# Altium schematic sheet nguyen li.SchDoc
size A3
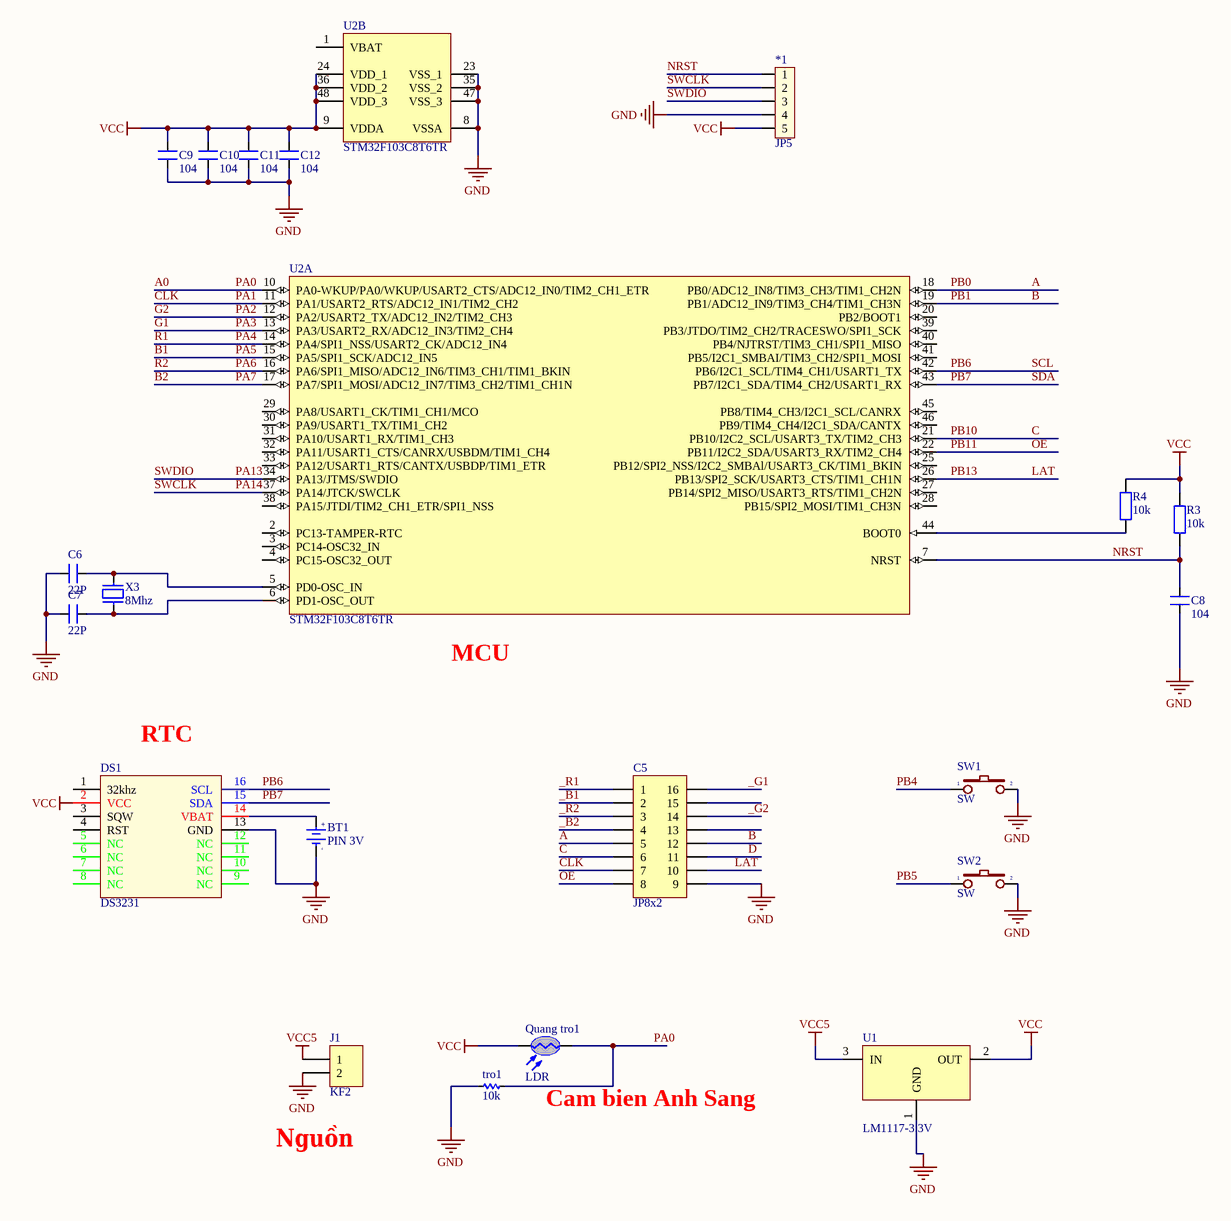
[diagram p0: nguyen li.SchDoc]

## Parts
*1  JP5  [JP5]
BT1  PIN 3V  [PIN CR1220-SMD]
C5  JP8x2  [JP8-D2T]
C6  22P  [0805]
C7  22P  [0805]
C8  104  [0805]
C9  104  [0805]
C10  104  [0805]
C11  104  [0805]
C12  104  [0805]
DS1  DS3231  [DS3231]
J1  KF2  [KF2-5.08]
Quang_tro1  LDR  [CDS]
R3  10k  [SM-RES-0805]
R4  10k  [SM-RES-0805]
SW1  SW  [SW1-SMD]
SW2  SW  [SW1-SMD]
tro1  10k  [RES-SMD-0805]
U1  LM1117-3.3V  [SOT223]
U2  STM32F103C8T6TR  [STM-LQFP48_N]  (parts A,B of 2)
X3  8Mhz  [XT2]

## Nets
GND: *1.4 BT1.2(GND) C5.9 C6.1 C7.1 C8.1 C9.2 C10.2 C11.2 C12.2 DS1.13(GND) J1.2 SW1.2 SW2.2 tro1.2 U1.1(GND) U2.8(VSSA) U2.23(VSS_1) U2.35(VSS_2) U2.47(VSS_3)
VCC: *1.5 C9.1 C10.1 C11.1 C12.1 DS1.2(VCC) Quang_tro1.2(K) R3.1 R4.1 U1.2(OUT) U2.9(VDDA) U2.24(VDD_1) U2.36(VDD_2) U2.48(VDD_3)
VCC5: J1.1 U1.3(IN)
_B1: C5.2
_B2: C5.4
_G1: C5.16
_G2: C5.14
_R1: C5.1
_R2: C5.3
A: C5.5 U2.18(PB0/ADC12_IN8/TIM3_CH3/TIM1_CH2N)  [also labelled PB0]
A0: Quang_tro1.1(A) tro1.1 U2.10(PA0-WKUP/PA0/WKUP/USART2_CTS/ADC12_IN0/TIM2_CH1_ETR)  [also labelled PA0]
B: C5.12 U2.19(PB1/ADC12_IN9/TIM3_CH4/TIM1_CH3N)  [also labelled PB1]
B1: U2.15(PA5/SPI1_SCK/ADC12_IN5)  [also labelled PA5]
B2: U2.17(PA7/SPI1_MOSI/ADC12_IN7/TIM3_CH2/TIM1_CH1N)  [also labelled PA7]
C: C5.6 U2.21(PB10/I2C2_SCL/USART3_TX/TIM2_CH3)  [also labelled PB10]
CLK: C5.7 U2.11(PA1/USART2_RTS/ADC12_IN1/TIM2_CH2)  [also labelled PA1]
D: C5.11
G1: U2.13(PA3/USART2_RX/ADC12_IN3/TIM2_CH4)  [also labelled PA3]
G2: U2.12(PA2/USART2_TX/ADC12_IN2/TIM2_CH3)  [also labelled PA2]
LAT: C5.10 U2.26(PB13/SPI2_SCK/USART3_CTS/TIM1_CH1N)  [also labelled PB13]
NRST: *1.1 C8.2 R3.2 U2.7(NRST)
OE: C5.8 U2.22(PB11/I2C2_SDA/USART3_RX/TIM2_CH4)  [also labelled PB11]
PA4: U2.14(PA4/SPI1_NSS/USART2_CK/ADC12_IN4)  [also labelled R1]
PA6: U2.16(PA6/SPI1_MISO/ADC12_IN6/TIM3_CH1/TIM1_BKIN)  [also labelled R2]
PA13: *1.3 U2.34(PA13/JTMS/SWDIO)  [also labelled SWDIO]
PA14: *1.2 U2.37(PA14/JTCK/SWCLK)  [also labelled SWCLK]
PB4: SW1.1
PB5: SW2.1
PB6: DS1.16(SCL) U2.42(PB6/I2C1_SCL/TIM4_CH1/USART1_TX)  [also labelled SCL]
PB7: DS1.15(SDA) U2.43(PB7/I2C1_SDA/TIM4_CH2/USART1_RX)  [also labelled SDA]
NetBT1_1: BT1.1(+3V) DS1.14(VBAT)
NetC6_2: C6.2 U2.5(PD0-OSC_IN) X3.1
NetC7_2: C7.2 U2.6(PD1-OSC_OUT) X3.2
NetR4_2: R4.2 U2.44(BOOT0)

Not connected (* = marked no-connect by the designer): C5 13 15; DS1 1(32khz) 3(SQW) 4(RST) 5(NC) 6(NC) 7(NC) 8(NC) 9(NC) 10(NC) 11(NC) 12(NC); U2 1(VBAT) 2(PC13-TAMPER-RTC) 3(PC14-OSC32_IN) 4(PC15-OSC32_OUT) 20(PB2/BOOT1) 25(PB12/SPI2_NSS/I2C2_SMBAl/USART3_CK/TIM1_BKIN) 27(PB14/SPI2_MISO/USART3_RTS/TIM1_CH2N) 28(PB15/SPI2_MOSI/TIM1_CH3N) 29(PA8/USART1_CK/TIM1_CH1/MCO) 30(PA9/USART1_TX/TIM1_CH2) 31(PA10/USART1_RX/TIM1_CH3) 32(PA11/USART1_CTS/CANRX/USBDM/TIM1_CH4) 33(PA12/USART1_RTS/CANTX/USBDP/TIM1_ETR) 38(PA15/JTDI/TIM2_CH1_ETR/SPI1_NSS) 39(PB3/JTDO/TIM2_CH2/TRACESWO/SPI1_SCK) 40(PB4/NJTRST/TIM3_CH1/SPI1_MISO) 41(PB5/I2C1_SMBAI/TIM3_CH2/SPI1_MOSI) 45(PB8/TIM4_CH3/I2C1_SCL/CANRX) 46(PB9/TIM4_CH4/I2C1_SDA/CANTX)

## Notes on the sheet
- (near U2) MCU
- (near DS1) RTC
- Nguồn
- Cam bien Anh Sang
- (in symbol PIN 3V) +; -

## Library data of the parts
BT1 = PIN 3V: Battery 3VDC; Value: PIN 3V
C5 = JP8x2: WR-PHD 2.54 mm Dual Socket Header; Manufacturer: W¨¹rth Elektronik eiSos GmbH; partNo: 61301621821; ComponentLink1 Description: Manufacturer; ComponentLink2 Description: Datasheet; NoPins: 16; Created Date: 29 March 2013; ComponentLink1URL: http://www.we-online.com; ComponentLink2URL: http://katalog.we-online.de/em/datasheet/6130xx21821.pdf; Created by: Karrer Zheng
C6-C12 = CM: Cap SMD; Value: 103
J1 = KF2: Manufacturer: Würth Elektronik eiSos GmbH; partNo: 691103110002; ComponentLink1 Description: Manufacturer; ComponentLink2 Description: Datasheet; NoPins: 2; Created Date: 29 October 2013; ComponentLink1URL: http://www.we-online.com; ComponentLink2URL: http://katalog.we-online.de/em/datasheet/6911031100xx.pdf; Created by: Karrer Zheng
Quang_tro1 = LDR: Quang Tro
R3 R4 = R1/4W: Resistor 1/4W; Value: R1/4W - 1K
SW1 SW2 = SW2: Switch button 2 pin; Value: SW chip 2 pin
tro1 = Res-SMD: Resistor; Manufacturer: Generic Components; Class: Passive; Published: 08/06/2000; Publisher: Altium Hobart Technology Centre
U1 = LM1117: 800mA Low-Dropout Linear Regulator; Creator: Nguyen Ba Bien; Website: http://group3i.net
U2 = STM32F103C8T6TR: ARM Cortex-M3 32-bit MCU, 64 KB Flash, 20 KB Internal RAM, 37 I/Os, 48-pin LQFP, -40 to 85 degC, Tape and Reel; A/D Converter: 2x12-bit (10 Channel); FLASH Size (Prog) (kB): 64; I/Os (High Current): 37; Internal RAM Size (kB): 20; Operating Frequency(F) (Processor speed) (MHz): 72; Supply Voltage(Vcc) min (V): 2; DatasheetVersion: Rev. 16; PackageVersion: Rev. 6, 06/2013; PackageReference: LQFP48; PackageDescription: 48-Pin Low Profile Quad Flat Package, 7 x 7 mm Body, 0.5 mm Pitch; Supplier 1: Digi-Key; Supplier Part Number 1: STM32F103C8T6TR-ND; Supplier 2: Mouser; Supplier Part Number 2: 511-STM32F103C8T6TR; Core: ARM Cortex-M3; Packing: Tape and Reel; Mounting Technology: Surface Mount; PartNumber: STM32F103C8T6TR; ComponentLink1Description: Manufacturer URL; ComponentLink1URL: http://www.st.com/web/en/home.html; ComponentLink2Description: Datasheet; ComponentLink2URL: http://www.st.com/st-web-ui/static/active/en/resource/technical/document/datasheet/CD00161566.pdf; ComponentLink3Description: Package Specification; ComponentLink3URL: http://www.st.com/st-web-ui/static/active/en/resource/technical/document/datasheet/DM00058181.pdf
X3 = XT2: Crystal, 32.768 KHz, -40 to 85 degC, 3.2 x 1.5 x 0.9 mm SMD; Value: 4Mhz